# Altium schematic sheet Concentrator and Cell Modem Headers.SchDoc: Modular Parent Motherboard
size Letter; DrawnBy: MTAN; Organization: Altium Limited; DocumentNumber: 1; Revision: B; SheetNumber: 1; SheetTotal: 6
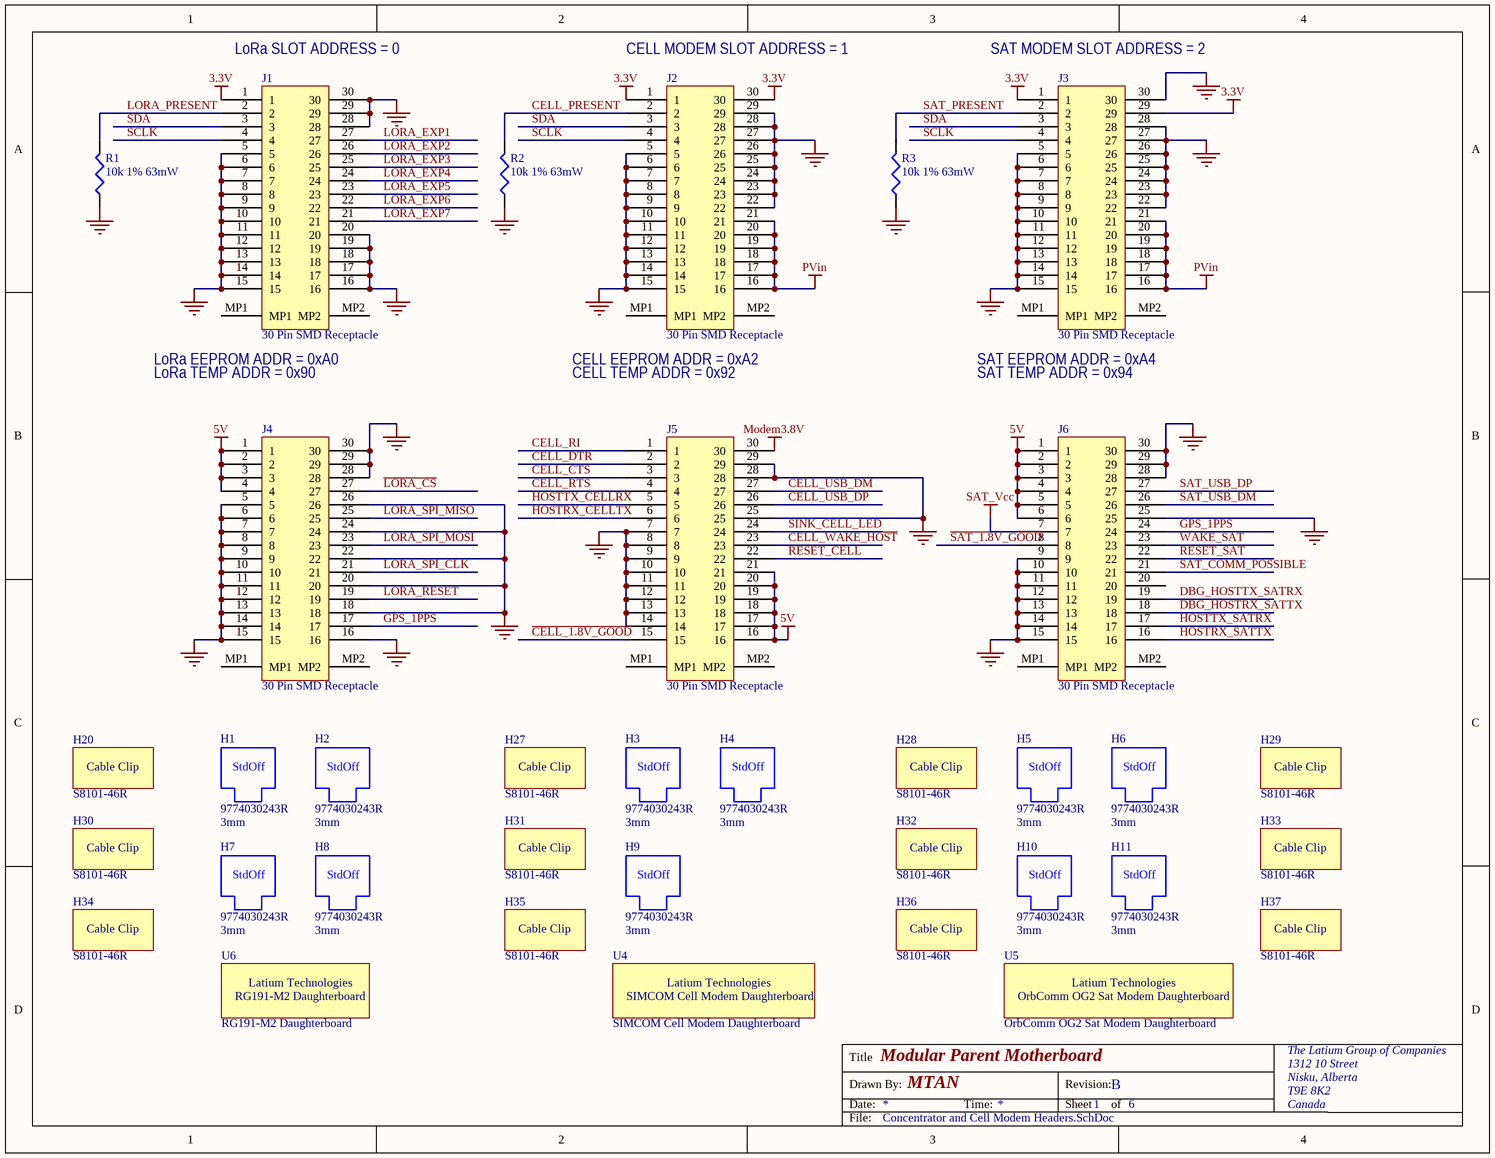
[diagram p0: Concentrator and Cell Modem Headers.SchDoc]

## Parts
H1  9774030243R  Height: 3mm  [Wurth 9774030243R]
H2  9774030243R  Height: 3mm  [Wurth 9774030243R]
H3  9774030243R  Height: 3mm  [Wurth 9774030243R]
H4  9774030243R  Height: 3mm  [Wurth 9774030243R]
H5  9774030243R  Height: 3mm  [Wurth 9774030243R]
H6  9774030243R  Height: 3mm  [Wurth 9774030243R]
H7  9774030243R  Height: 3mm  [Wurth 9774030243R]
H8  9774030243R  Height: 3mm  [Wurth 9774030243R]
H9  9774030243R  Height: 3mm  [Wurth 9774030243R]
H10  9774030243R  Height: 3mm  [Wurth 9774030243R]
H11  9774030243R  Height: 3mm  [Wurth 9774030243R]
H20  S8101-46R  [Coax Cable Clip]
H27  S8101-46R  [Coax Cable Clip]
H28  S8101-46R  [Coax Cable Clip]
H29  S8101-46R  [Coax Cable Clip]
H30  S8101-46R  [Coax Cable Clip]
H31  S8101-46R  [Coax Cable Clip]
H32  S8101-46R  [Coax Cable Clip]
H33  S8101-46R  [Coax Cable Clip]
H34  S8101-46R  [Coax Cable Clip]
H35  S8101-46R  [Coax Cable Clip]
H36  S8101-46R  [Coax Cable Clip]
H37  S8101-46R  [Coax Cable Clip]
J1  30 Pin SMD Receptacle  [10132798-031100LF]
J2  30 Pin SMD Receptacle  [10132798-031100LF]
J3  30 Pin SMD Receptacle  [10132798-031100LF]
J4  30 Pin SMD Receptacle  [10132798-031100LF]
J5  30 Pin SMD Receptacle  [10132798-031100LF]
J6  30 Pin SMD Receptacle  [10132798-031100LF]
R1  10k 1% 63mW  [RESC1005L]
R2  10k 1% 63mW  [RESC1005L]
R3  10k 1% 63mW  [RESC1005L]
U4  SIMCOM Cell Modem Daughterboard  [SIMCOM Cell Modem Daughterboard]  (no BOM)
U5  OrbComm OG2 Sat Modem Daughterboard  [OrbComm OG2 Daughterboard]  (no BOM)
U6  RG191-M2 Daughterboard  [RG191-M2 LoRa Daughterboard]  (no BOM)

## Nets
3.3V: J1.1 J2.1 J2.30 J3.1 J3.29
5V: J4.1 J4.2 J4.3 J4.4 J5.16 J5.17 J5.18 J5.19 J5.20 J5.21 J6.1 J6.2 J6.3 J6.4 J6.5 J6.6
GND: J1.5 J1.6 J1.7 J1.8 J1.9 J1.10 J1.11 J1.12 J1.13 J1.14 J1.15 J1.16 J1.17 J1.18 J1.19 J1.20 J1.28 J1.29 J1.30 J2.5 J2.6 J2.7 J2.8 J2.9 J2.10 J2.11 J2.12 J2.13 J2.14 J2.15 J2.22 J2.23 J2.24 J2.25 J2.26 J2.27 J2.28 J2.29 J3.5 J3.6 J3.7 J3.8 J3.9 J3.10 J3.11 J3.12 J3.13 J3.14 J3.15 J3.22 J3.23 J3.24 J3.25 J3.26 J3.27 J3.28 J3.30 J4.5 J4.6 J4.7 J4.8 J4.9 J4.10 J4.11 J4.12 J4.13 J4.14 J4.15 J4.16 J4.18 J4.20 J4.22 J4.24 J4.26 J4.28 J4.29 J4.30 J5.7 J5.8 J5.9 J5.10 J5.11 J5.12 J5.13 J5.14 J5.25 J5.28 J5.29 J6.9 J6.10 J6.11 J6.12 J6.13 J6.14 J6.15 J6.25 J6.28 J6.29 J6.30 R1.1 R2.1 R3.1
Modem3.8V: J5.30
PVin: J2.16 J2.17 J2.18 J2.19 J2.20 J2.21 J3.16 J3.17 J3.18 J3.19 J3.20 J3.21
SAT_Vcc: J6.7
~{CELL_1.8V_GOOD}: J5.15
~{CELL_WAKE_HOST}: J5.23
CELL_CTS: J5.3
CELL_DTR: J5.2
CELL_PRESENT: J2.2 R2.2
CELL_RI: J5.1
CELL_RTS: J5.4
CELL_USB_DM: J5.27
CELL_USB_DP: J5.26
DBG_HOSTRX_SATTX: J6.18
DBG_HOSTTX_SATRX: J6.19
GPS_1PPS: J4.17 J6.24
HOSTRX_CELLTX: J5.6
HOSTRX_SATTX: J6.16
HOSTTX_CELLRX: J5.5
HOSTTX_SATRX: J6.17
~{LORA_CS}: J4.27
LORA_EXP1: J1.27
LORA_EXP2: J1.26
LORA_EXP3: J1.25
LORA_EXP4: J1.24
LORA_EXP5: J1.23
LORA_EXP6: J1.22
LORA_EXP7: J1.21
LORA_PRESENT: J1.2 R1.2
LORA_RESET: J4.19
LORA_SPI_CLK: J4.21
LORA_SPI_MISO: J4.25
LORA_SPI_MOSI: J4.23
RESET_CELL: J5.22
RESET_SAT: J6.22
~{SAT_1.8V_GOOD}: J6.8
~{SINK_CELL_LED}: J5.24
SAT_COMM_POSSIBLE: J6.21
SAT_PRESENT: J3.2 R3.2
SAT_USB_DM: J6.26
SAT_USB_DP: J6.27
SCLK: J1.4 J2.4 J3.4
SDA: J1.3 J2.3 J3.3
WAKE_SAT: J6.23

Not connected (* = marked no-connect by the designer): J1 MP1 MP2; J2 MP1 MP2; J3 MP1 MP2; J4 MP1 MP2; J5 MP1 MP2; J6 20 MP1 MP2

## Notes on the sheet
- (near J1) LoRa SLOT ADDRESS = 0
- (near J2) CELL MODEM SLOT ADDRESS = 1
- (near J3) SAT MODEM SLOT ADDRESS = 2
- (near J1) LoRa EEPROM ADDR = 0xA0
- (near J2) CELL EEPROM ADDR = 0xA2
- (near J3) SAT EEPROM ADDR = 0xA4
- LoRa TEMP ADDR = 0x90
- CELL TEMP ADDR = 0x92
- SAT TEMP ADDR = 0x94
- Title
- Drawn By:
- Date:
- Time:
- Revision:
- Sheet
- of
- The Latium Group of Companies
- 1312 10 Street
- Nisku, Alberta
- T9E 8K2
- Canada
- File:
- (in symbol OrbComm OG2 Sat Modem Daughterboard) Latium Technologies
- (in symbol RG191-M2 Daughterboard) Latium Technologies
- (in symbol SIMCOM Cell Modem Daughterboard) Latium Technologies
- (in symbol SMD M3 Spacer) StdOff

## Library data of the parts
H1-H11 = SMD M3 Spacer: ROUND STANDOFF M2X0.4 STEEL 3MM; Manufacturer: Wurth Electronics Inc; Supplier 1: Digi-Key; Value: 9774030243R; Manufacturer Part Number: 9774030243R; ComponentLink1Description: Drawing; ComponentLink1URL: S:\Hardware\Data Sheets\Passive\Standoffs\Wurth 9774070360R.pdf; Supplier 1 Part Number: 732-7085-1-ND
H20 H27-H37 = Cable Clip: CBL CLIP C-TYPE SILVER SOLDER; Manufacturer: Harwin Inc; Value: S8101-46R; ComponentLink1Description: Drawing; ComponentLink1URL: S:\Hardware\Data Sheets\Passive\Strain Reliefs\S8101R.pdf; Manufacturer Part Number: S8101-46R; Supplier 1: Digi-Key; Supplier 1 Part Number: 952-1576-1-ND
J1-J6 = Amphenol 30 Pos BergStak Plug: CONN RCPT 30POS SMD GOLD; Manufacturer: Amphenol ICC (FCI); Note: Mates with 10132797-031100LF plug 3mm between board height; Value: 30 Pin SMD Receptacle; Manufacturer Part Number: 10132798-031100LF; Supplier 1: Digi-Key; Supplier 1 Part Number: 609-5030-1-ND
R1-R3 = Res3: Resistor; Value: 10k 1% 63mW
U4 = SIMCOM Cell Modem Daughterboard: Value: SIMCOM Cell Modem Daughterboard
U5 = OrbComm OG2 Sat Modem Daughterboard: Value: OrbComm OG2 Sat Modem Daughterboard
U6 = RG191-M2 Daughterboard: Value: RG191-M2 Daughterboard